# Altium project MiniPC MB GOST.PrjPcb (part 15 of 31)

## Sheet Converter 3V3-0V9 V2.SchDoc
size 420 x 297 mm; Author: ALTIUM GOSTBOM2.0 KEV; SheetNumber: 37; SheetTotal: 48
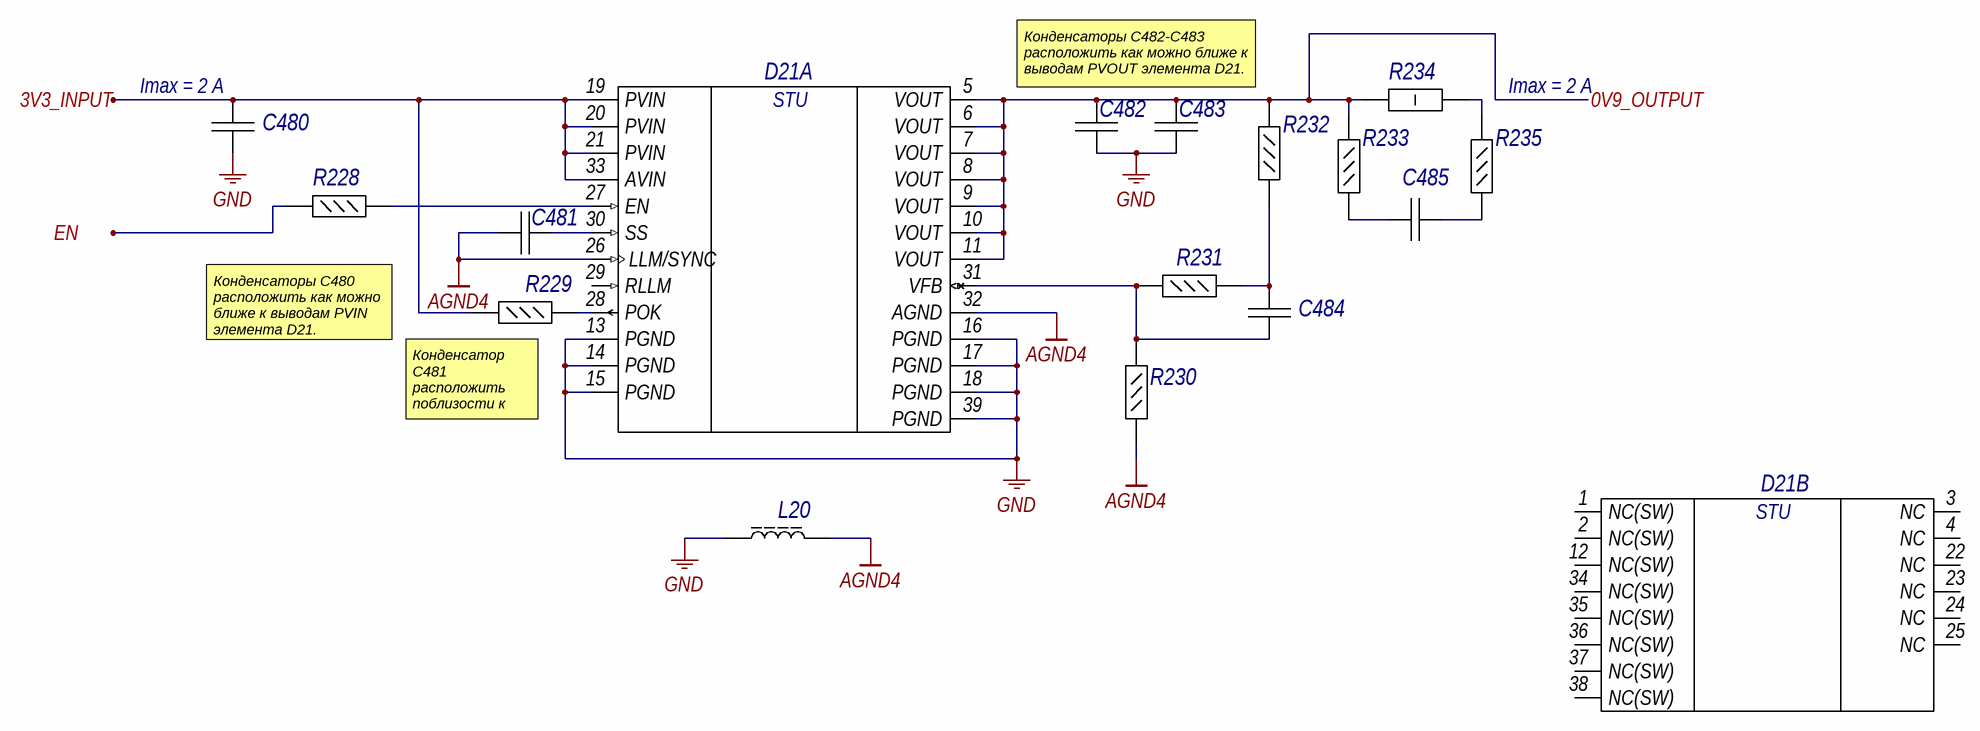
[diagram p19: Converter 3V3-0V9 V2.SchDoc]

### Parts
C480  GRM31CR61E226KE15L  [CAPC3216X180X55ML20T25]  (value not drawn)
C481  VJ0402Y153JXQPW1BC  [CAPC1005X55X23ML05T8]  (value not drawn)
C482  C3216X5R1A476M160AB  [CAPC3216X180X20ML20]  (value not drawn)
C483  C3216X5R1A476M160AB  [CAPC3216X180X20ML20]  (value not drawn)
C484  ECJ-0EC1H150J  [CAPC1005X55X20ML5T10]  (value not drawn)
C485  CGB2A1X5R1E105K033BC  [CAPC1005X33X10LL5]  (value not drawn)
D21  EN6337QI  [ALTR-QFN-38_A-190_D1-193_V]  (value not drawn)  (parts A,B of 2)
L20  742792609  [SMD-0603]  (value not drawn)
R228  NRC04F49R9TRF  [RESC1005X35X25NL8T10]  (value not drawn)
R229  ERJ-2RKF1003X  [RESC1005X40X25LL05T05]  (value not drawn)
R230  ERJ-2RKF1004X  [RESC1005X40X25LL05T05]  (value not drawn)
R231  ERJ-2RKF2003X  [RESC1005X40X25LL05T05]  (value not drawn)
R232  ERJ-2GE0R00X  [RESC1005X40X25LL05T05]  (value not drawn)
R233  ERJ-2RKF1002X  [RESC1005X40X25LL05T05]  (value not drawn)
R234  WSLP12061L000FEA  [RESC3216X89X104LL25T25]  (value not drawn)
R235  ERJ-2RKF1002X  [RESC1005X40X25LL05T05]  (value not drawn)

### Ports
0V9_OUTPUT, 3V3_INPUT, EN

### Nets
AGND4: C481.1 D21.26(LLM/SYNC) D21.32(AGND) L20.2 R230.1
GND: C480.1 C482.1 C483.1 D21.13(PGND) D21.14(PGND) D21.15(PGND) D21.16(PGND) D21.17(PGND) D21.18(PGND) D21.39(PGND) L20.1
0V95: C482.2 C483.2 D21.5(VOUT) D21.6(VOUT) D21.7(VOUT) D21.8(VOUT) D21.9(VOUT) D21.10(VOUT) D21.11(VOUT) R232.1 R233.2 R234.2 ; port 0V9_OUTPUT
3V3_OUTPUT: C480.2 D21.19(PVIN) D21.20(PVIN) D21.21(PVIN) D21.33(AVIN) R229.1 ; port 3V3_INPUT
NetC481_2: C481.2 D21.30(SS)
NetC484_1: C484.1 D21.31(VFB) R230.2 R231.1
NetC484_2: C484.2 R231.2 R232.2
NetC485_1: C485.1 R233.1
NetC485_2: C485.2 R235.1
NetD21_27: D21.27(EN) R228.2
NetD21_28: D21.28(POK) R229.2
NetR213_2: R228.1 ; port EN
NetR234_1: R234.1 R235.2

Not connected (* = marked no-connect by the designer): D21 1(NC(SW)) 2(NC(SW)) 3(NC) 4(NC) 12(NC(SW)) 22(NC) 23(NC) 24(NC) 25(NC) 29(RLLM) 34(NC(SW)) 35(NC(SW)) 36(NC(SW)) 37(NC(SW)) 38(NC(SW))

### Notes on the sheet
- Конденсаторы C482-C483 расположить как можно ближе к выводам PVOUT элемента D21.
- (near C480) Imax = 2 А
- Imax = 2 А
- Конденсаторы C480 расположить как можно ближе к выводам PVIN элемента D21.
- (near R229) Конденсатор C481 расположить поблизости к D21:30.
- Подп. дата
- Инв. № дубл.
- Взам. инв. №
- Подп. и дата
- Инв. № подл.
- Изм.
- Лист
- № докум.
- Подп.
- Дата
- ALTIUM GOSTBOM2.0 KEV
- Файл:
- Копировал
- Формат А3
- (in symbol E108, part A) STU
- (in symbol E108, part B) STU

### Library data of the parts
C480 = E5: Chip Capacitor, 22 uF, +/- 10%, 25 V, -55 to 85 degC, 1206 (3216 Metric), RoHS, Tape and Reel; Тип элемента: Конденсатор; Capacitance: 22 uF; Case\/Package: 1206; Type (Capacitors): X5R; Voltage Rating: 25 V; Old_des: C45; New_des: C480; UID: E5; Component Kind: Standard; Case Code (Imperial): 1206; Case Code (Metric): 3216; ComponentLink1Description: Manufacturer URL; ComponentLink1URL: http://www.murata.com/; ComponentLink2Description: Datasheet; ComponentLink2URL: http://search.murata.co.jp/Ceramy/image/img/A01X/G101/ENG/GRM31CR61E226KE15-01.pdf; DatasheetVersion: 03/2016; Length: 3.2 mm; Max Operating Temperature: 85 degC; Min Operating Temperature: -55 degC; Mounting Technology: Surface Mount; Package Quantity: 2000; PackageDescription: 2-Pin Surface Mount Device, Body 3.2 x 1.6 mm; Packaging: Tape and Reel; PartNumber: GRM31CR61E226KE15L; RoHSCompliant: true; Tolerance: 10%; Width: 1.6 mm; Height: 1.6 mm; Mount: Surface Mount; PackageReference: 1206; Pins: 2; Radiation Hardening: No; REACH SVHC: No SVHC; Voltage Rating (DC): 25 V
C481 = E8: Chip Capacitor, 15 nF, +/- 5%, 10 V, -55 to 125 degC, 0402 (1005 Metric), RoHS, Tape and Reel; Тип элемента: Конденсатор; Capacitance: 15 nF; Case\/Package: 0402; Type (Capacitors): X7R; Voltage Rating: 10 V; Old_des: C49; New_des: C481; UID: E8; Component Kind: Standard; Case Code (Imperial): 0402; Case Code (Metric): 1005; ComponentLink1Description: Manufacturer URL; ComponentLink1URL: http://www.vishay.com/; ComponentLink2Description: Datasheet; ComponentLink2URL: http://www.vishay.com/docs/28548/vjw1bcbascomseries.pdf; DatasheetVersion: 07/2016; Length: 1 mm; Max Operating Temperature: 125 degC; Min Operating Temperature: -55 degC; Mounting Technology: Surface Mount; Package Quantity: 50000; PackageDescription: 2-Pin Surface Mount Device, Body 1 x 0.5 mm; Packaging: Tape and Reel; PartNumber: VJ0402Y153JXQPW1BC; RoHSCompliant: true; Tolerance: 5%; Width: 0.5 mm; Height: 0.5 mm; Mount: Surface Mount; PackageReference: 0402; Pins: 2; Voltage Rating (DC): 10 V
C482 = E6: Chip Capacitor, 47 uF, +/- 20%, 10 V, -55 to 85 degC, 1206 (3216 Metric), RoHS, Tape and Reel; Тип элемента: Конденсатор; Capacitance: 47 uF; Case\/Package: 1206; Type (Capacitors): X5R; Voltage Rating: 10 V; Old_des: C46; New_des: C482; UID: E6; Component Kind: Standard; Case Code (Imperial): 1206; Case Code (Metric): 3216; ComponentLink1Description: Manufacturer URL; ComponentLink1URL: http://www.tdk.com/; ComponentLink2Description: Datasheet; ComponentLink2URL: https://product.tdk.com/info/en/catalog/datasheets/mlcc_commercial_general_en.pdf; DatasheetVersion: 03/2015; Length: 3.2 mm; Max Operating Temperature: 85 degC; Min Operating Temperature: -55 degC; Mounting Technology: Surface Mount; Package Quantity: 2000; PackageDescription: 2-Pin Surface Mount Device, Body 3.2 x 1.6 mm; Packaging: Tape and Reel; RoHSCompliant: true; Tolerance: 20%; Width: 1.6 mm; Height: 1.6 mm; Mount: Surface Mount; PackageReference: 3216; Radiation Hardening: No; Voltage Rating (DC): 10 V
C483 = E6: Chip Capacitor, 47 uF, +/- 20%, 10 V, -55 to 85 degC, 1206 (3216 Metric), RoHS, Tape and Reel; Тип элемента: Конденсатор; Capacitance: 47 uF; Case\/Package: 1206; Type (Capacitors): X5R; Voltage Rating: 10 V; Old_des: C47; New_des: C483; UID: E6; Component Kind: Standard; Case Code (Imperial): 1206; Case Code (Metric): 3216; ComponentLink1Description: Manufacturer URL; ComponentLink1URL: http://www.tdk.com/; ComponentLink2Description: Datasheet; ComponentLink2URL: https://product.tdk.com/info/en/catalog/datasheets/mlcc_commercial_general_en.pdf; DatasheetVersion: 03/2015; Length: 3.2 mm; Max Operating Temperature: 85 degC; Min Operating Temperature: -55 degC; Mounting Technology: Surface Mount; Package Quantity: 2000; PackageDescription: 2-Pin Surface Mount Device, Body 3.2 x 1.6 mm; Packaging: Tape and Reel; RoHSCompliant: true; Tolerance: 20%; Width: 1.6 mm; Height: 1.6 mm; Mount: Surface Mount; PackageReference: 3216; Radiation Hardening: No; Voltage Rating (DC): 10 V
C484 = E10: Chip Capacitor,15 pF, +/- 5%, 50 V, -55 to 125 degC, 0402 (1005 Metric), RoHS, Tape and Reel; Тип элемента: Конденсатор; Capacitance: 15 pF; Case\/Package: 0402; Type (Capacitors): C0G; Voltage Rating: 50 V; Old_des: C48; New_des: C484; UID: E10; Component Kind: Standard; Case Code (Imperial): 0402; Case Code (Metric): 1005; ComponentLink1Description: Manufacturer URL; ComponentLink1URL: http://www.panasonic.com/; ComponentLink2Description: Datasheet; ComponentLink2URL: http://www.mouser.com/ds/2/315/panasonic_abj0000ce4-327307.pdf; DatasheetVersion: 09/2008; Length: 0.039 inch; Max Operating Temperature: 125 degC; Min Operating Temperature: -55 degC; Mounting Technology: Surface Mount; Package Quantity: 10000; PackageDescription: 2-Pin Surface Mount Device, Body 1 x 0.5 mm; Packaging: Tape and Reel; RoHSCompliant: true; Tolerance: 5%; Width: 0.02 inch; Height: 0.5 mm; Mount: Surface Mount; PackageReference: 0402
C485 = E2: Chip Capacitor, 1 uF, +/- 10%, 25 V, -55 to 85 degC, 0402 (1005 Metric), RoHS, Tape and Reel; Тип элемента: Конденсатор; Capacitance: 1 uF; Old_des: C44; New_des: C485; UID: E2; Component Kind: Standard; Case Code (Imperial): 0402; Case Code (Metric): 1005; Case/Package: 0402; ComponentLink1Description: Manufacturer URL; ComponentLink1URL: http://www.tdk.com/; ComponentLink2Description: Datasheet; ComponentLink2URL: https://product.tdk.com/info/en/catalog/datasheets/mlcc_commercial_lowprofile_en.pdf; DatasheetVersion: 04/2015; Length: 0.039 inch; Max Operating Temperature: 85 degC; Min Operating Temperature: -55 degC; Mounting Technology: Surface Mount; Package Quantity: 1; PackageDescription: 2-Pin Surface Mount Device, Body 1 x 0.5 mm; Packaging: Tape and Reel; PartNumber: CGB2A1X5R1E105K033BC; RoHSCompliant: True; Tolerance: 10%; Width: 0.02 inch
D21 = E108: PowerSoC Voltage Mode Synchronous PWM Buck with Integrated Inductor, 2.5 to 6.6 V Input, -40 to 85 degC, 38-Pin QFN, RoHS, Tape and Reel; Тип элемента: Стабилизатор; Output Current: 3 A; Old_des: U6; New_des: D21; UID: E108; Component Kind: Standard; ComponentLink1Description: Manufacturer URL; ComponentLink1URL: https://www.altera.com/; ComponentLink2Description: Datasheet; ComponentLink2URL: https://www.altera.com/content/dam/altera-www/global/en_US/pdfs/literature/ds/en6337qi_05800.pdf; DatasheetVersion: Rev. E; Length: 0.28 inch; Max Operating Temperature: 85 degC; Min Operating Temperature: -40 degC; Mounting Technology: Surface Mount; Package Quantity: 500; PackageDescription: 38-Pin Quad Flat No-Leads Package, Body 7 x 4 mm, Pitch 0.5 mm, Thermal Pad 2.6 x 1.94 mm; Packaging: Tape and Reel; PartNumber: EN6337QI; RoHSCompliant: True; Width: 0.16 inch; Height: 0.07 inch; Mount: Surface Mount; Pins: 38; Radiation Hardening: No
L20 = E45: SMD EMI Suppression Ferrite Bead WE-CBF, Z = 30 Ohm; Тип элемента: Ферритовый дроссель; Impedance: 30 Ohm; Old_des: L5; New_des: L20; UID: E45; Component Kind: Standard; ComponentLink1Description: Manufacturer Link; ComponentLink1URL: http://www.we-online.com; ComponentLink2Description: Datasheet; ComponentLink2URL: http://www.we-online.de/katalog/media/pdf/742792609.pdf; DatasheetVersion: Dec-2005; PackageDescription: Chip Inductor, 2-Leads, Body 1.6 x 0.8 mm; PackageReference: SMD-0603; PackageVersion: 2009
R228 = E67: Chip Resistor, 49.9 Ohm, +/- 1%, 0.06 W, -55 to 155 degC, 0402 (1005 Metric), RoHS, Tape and Reel; Тип элемента: Резистор; Old_des: R87; New_des: R228; UID: E67; Component Kind: Standard; Case/Package: 0402; ComponentLink1Description: Manufacturer URL; ComponentLink1URL: http://www.niccomp.com/; ComponentLink2Description: Datasheet; ComponentLink2URL: https://datasheet.ciiva.com/27056/2008575-27056094.pdf; DatasheetVersion: 11/2008; Length: 1 mm; Max Operating Temperature: 155 degC; Min Operating Temperature: -55 degC; Mounting Technology: Surface Mount; PackageDescription: 2-Pin Surface Mount Device, Body 1 x 0.5 mm; Packaging: Tape and Reel; PartNumber: NRC04F49R9TRF; RoHSCompliant: True; Tolerance: 1%; Height: 0.3 mm; Radiation Hardening: No; Resistance: 49.9 Ohm
R229 = E58: Chip Resistor, 100 KOhm, +/- 1%, 100 mW, -55 to 155 degC, 0402 (1005 Metric), RoHS, Tape and Reel; Manufacturer: Basic Passives; Тип элемента: Резистор; Case\/Package: 0402; Voltage Rating: 50 V; Power Rating: 100 mW; Old_des: R89; New_des: R229; UID: E58; Component Kind: Standard; Case Code (Imperial): 0402; Case Code (Metric): 1005; ComponentLink1Description: Manufacturer URL; ComponentLink1URL: http://www.panasonic.com/; ComponentLink2Description: Datasheet; ComponentLink2URL: http://industrial.panasonic.com/cdbs/www-data/pdf/RDA0000/AOA0000C86.pdf; DatasheetVersion: 04/2015; Length: 1 mm; Max Operating Temperature: 155 degC; Min Operating Temperature: -55 degC; Mounting Technology: Surface Mount; Package Quantity: 10000; PackageDescription: 2-Pin Surface Mount Device, Body 1 x 0.5 mm; Packaging: Tape and Reel; PartNumber: ERJ-2RKF1003X; RoHSCompliant: true; Tolerance: 1%; Width: 0.5 mm; Height: 0.35 mm; Mount: Surface Mount; PackageReference: 0402; Pins: 2; Radiation Hardening: No; REACH SVHC: Yes; Resistance: 100 KOhm
R230 = E81: Chip Resistor, 1 MOhm, +/- 1%, 100 mW, -55 to 155 degC, 0402 (1005 Metric), RoHS, Tape and Reel; Manufacturer: Basic Passives; Тип элемента: Резистор; Case\/Package: 0402; Voltage Rating: 50 V; Power Rating: 100 mW; Resistance: 1 MOhm; Old_des: R88; New_des: R230; UID: E81; Component Kind: Standard; Case Code (Imperial): 0402; Case Code (Metric): 1005; ComponentLink1Description: Manufacturer URL; ComponentLink1URL: http://www.panasonic.com/; ComponentLink2Description: Datasheet; ComponentLink2URL: http://industrial.panasonic.com/cdbs/www-data/pdf/RDA0000/AOA0000C86.pdf; DatasheetVersion: 04/2015; Length: 1 mm; Max Operating Temperature: 155 degC; Min Operating Temperature: -55 degC; Mounting Technology: Surface Mount; Package Quantity: 10000; PackageDescription: 2-Pin Surface Mount Device, Body 1 x 0.5 mm; Packaging: Tape and Reel; PartNumber: ERJ-2RKF1004X; RoHSCompliant: true; Tolerance: 1%; Width: 0.5 mm; Height: 0.35 mm; Mount: Surface Mount; PackageReference: 0402; Pins: 2; Radiation Hardening: No; REACH SVHC: Yes; Weight: 2.8E-05oz
R231 = E80: Chip Resistor, 200 KOhm, +/- 1%, 100 mW, -55 to 155 degC, 0402 (1005 Metric), RoHS, Tape and Reel; Manufacturer: Basic Passives; Тип элемента: Резистор; Case\/Package: 0402; Voltage Rating: 50 V; Power Rating: 100 mW; Old_des: R86; New_des: R231; UID: E80; Component Kind: Standard; Case Code (Imperial): 0402; Case Code (Metric): 1005; ComponentLink1Description: Manufacturer URL; ComponentLink1URL: http://www.panasonic.com/; ComponentLink2Description: Datasheet; ComponentLink2URL: http://industrial.panasonic.com/cdbs/www-data/pdf/RDA0000/AOA0000C86.pdf; DatasheetVersion: 04/2015; Length: 1 mm; Max Operating Temperature: 155 degC; Min Operating Temperature: -55 degC; Mounting Technology: Surface Mount; Package Quantity: 10000; PackageDescription: 2-Pin Surface Mount Device, Body 1 x 0.5 mm; Packaging: Tape and Reel; PartNumber: ERJ-2RKF2003X; RoHSCompliant: true; Tolerance: 1%; Width: 0.5 mm; Height: 0.35 mm; Mount: Surface Mount; PackageReference: 0402; Pins: 2; Radiation Hardening: No; REACH SVHC: No SVHC; Resistance: 200 KOhm
R232 = E64: Chip Resistor, 0 mOhm, +/- 5%, 100 mW, -55 to 155 degC, 0402 (1005 Metric), RoHS, Tape and Reel; Manufacturer: Basic Passives; Тип элемента: Резистор; Case\/Package: 0402; Voltage Rating: 50 V; Power Rating: 100 mW; Resistance: 0 mOhm; Old_des: R85; New_des: R232; UID: E64; Component Kind: Standard; Case Code (Imperial): 0402; Case Code (Metric): 1005; ComponentLink1Description: Manufacturer URL; ComponentLink1URL: http://www.panasonic.com/; ComponentLink2Description: Datasheet; ComponentLink2URL: http://industrial.panasonic.com/cdbs/www-data/pdf/RDA0000/AOA0000C84.pdf; DatasheetVersion: 03/2015; Length: 1 mm; Max Operating Temperature: 155 degC; Min Operating Temperature: -55 degC; Mounting Technology: Surface Mount; Package Quantity: 10000; PackageDescription: 2-Pin Surface Mount Device, Body 1 x 0.5 mm; Packaging: Tape and Reel; PartNumber: ERJ-2GE0R00X; RoHSCompliant: true; Tolerance: 5%; Width: 0.5 mm; Height: 0.35 mm; Mount: Surface Mount; PackageReference: 0402; Pins: 2; Radiation Hardening: No; REACH SVHC: Unknown
R233 = E60: Chip Resistor, 10 KOhm, +/- 1%, 100 mW, -55 to 155 degC, 0402 (1005 Metric), RoHS, Tape and Reel; Manufacturer: Basic Passives; Тип элемента: Резистор; Case\/Package: 0402; Voltage Rating: 50 V; Power Rating: 100 mW; Resistance: 10 KOhm; Old_des: R84; New_des: R233; UID: E60; Component Kind: Standard; Case Code (Imperial): 0402; Case Code (Metric): 1005; ComponentLink1Description: Manufacturer URL; ComponentLink1URL: http://www.panasonic.com/; ComponentLink2Description: Datasheet; ComponentLink2URL: http://industrial.panasonic.com/cdbs/www-data/pdf/RDA0000/AOA0000C86.pdf; DatasheetVersion: 04/2015; Length: 1 mm; Max Operating Temperature: 155 degC; Min Operating Temperature: -55 degC; Mounting Technology: Surface Mount; Package Quantity: 10000; PackageDescription: 2-Pin Surface Mount Device, Body 1 x 0.5 mm; Packaging: Tape and Reel; PartNumber: ERJ-2RKF1002X; RoHSCompliant: true; Tolerance: 1%; Width: 0.5 mm; Height: 0.35 mm; Mount: Surface Mount; PackageReference: 0402; Pins: 2; Radiation Hardening: No; REACH SVHC: Yes
R234 = E65: Chip Resistor, 0.001 Ohm, +/- 1%, 1 W, -65 to 170 degC, 1206 (3216 Metric), RoHS, Tape and Reel; Тип элемента: Резистор; Old_des: R83; New_des: R234; UID: E65; Component Kind: Standard; Case Code (Imperial): 1206; Case Code (Metric): 3216; Case/Package: 1206; ComponentLink1Description: Manufacturer URL; ComponentLink1URL: http://www.vishay.com/; ComponentLink2Description: Datasheet; ComponentLink2URL: http://www.farnell.com/datasheets/2049155.pdf; DatasheetVersion: 04/2015; Length: 3.2 mm; Max Operating Temperature: 170 degC; Min Operating Temperature: -65 degC; Mounting Technology: Surface Mount; PackageDescription: 2-Pin Surface Mount Device, Body 3.2 x 1.6 mm; Packaging: Tape and Reel; PartNumber: WSLP12061L000FEA; RoHSCompliant: True; Tolerance: 1%; Width: 1.6 mm; Height: 0.635 mm; REACH SVHC: Unknown; Resistance: 0.001 Ohm
R235 = E60: Chip Resistor, 10 KOhm, +/- 1%, 100 mW, -55 to 155 degC, 0402 (1005 Metric), RoHS, Tape and Reel; Manufacturer: Basic Passives; Тип элемента: Резистор; Case\/Package: 0402; Voltage Rating: 50 V; Power Rating: 100 mW; Resistance: 10 KOhm; Old_des: R82; New_des: R235; UID: E60; Component Kind: Standard; Case Code (Imperial): 0402; Case Code (Metric): 1005; ComponentLink1Description: Manufacturer URL; ComponentLink1URL: http://www.panasonic.com/; ComponentLink2Description: Datasheet; ComponentLink2URL: http://industrial.panasonic.com/cdbs/www-data/pdf/RDA0000/AOA0000C86.pdf; DatasheetVersion: 04/2015; Length: 1 mm; Max Operating Temperature: 155 degC; Min Operating Temperature: -55 degC; Mounting Technology: Surface Mount; Package Quantity: 10000; PackageDescription: 2-Pin Surface Mount Device, Body 1 x 0.5 mm; Packaging: Tape and Reel; PartNumber: ERJ-2RKF1002X; RoHSCompliant: true; Tolerance: 1%; Width: 0.5 mm; Height: 0.35 mm; Mount: Surface Mount; PackageReference: 0402; Pins: 2; Radiation Hardening: No; REACH SVHC: Yes

## Sheet Ethernet Interface Group.SchDoc
size 209 x 297 mm; Author: ALTIUM GOSTBOM2.0 KEV; SheetNumber: 9; SheetTotal: 48
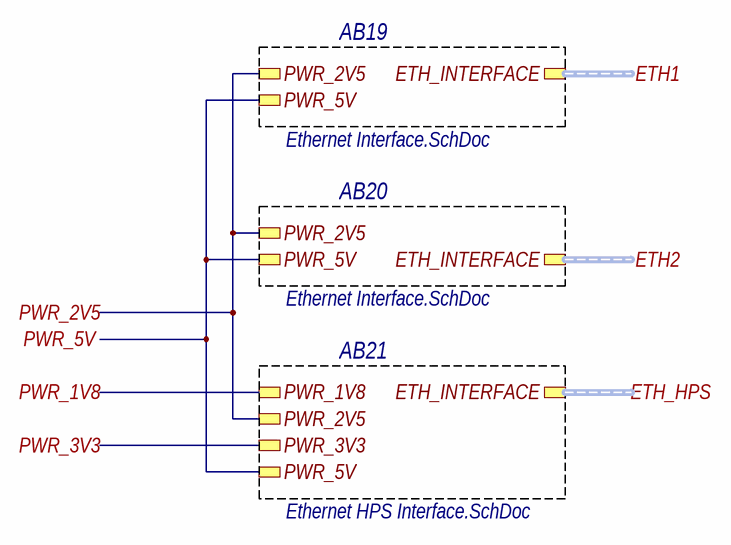
[diagram p20: Ethernet Interface Group.SchDoc]

### Sub-sheets
AB19 = Ethernet Interface.SchDoc: PWR_5V, ETH_INTERFACE (harness ETHERNET), PWR_2V5
AB20 = Ethernet Interface.SchDoc: PWR_5V, ETH_INTERFACE (harness ETHERNET), PWR_2V5
AB21 = Ethernet HPS Interface.SchDoc: ETH_INTERFACE (harness ETHERNET_HPS), PWR_5V, PWR_3V3, PWR_2V5, PWR_1V8

### Ports
ETH1 (harness ETHERNET), ETH2 (harness ETHERNET), ETH_HPS (harness ETHERNET_HPS), PWR_1V8, PWR_2V5, PWR_3V3, PWR_5V

### Nets
IO_1V8: port PWR_1V8, sheet AB21/PWR_1V8
IO_2V5: port PWR_2V5, sheet AB19/PWR_2V5, sheet AB21/PWR_2V5, sheet AB20/PWR_2V5
IO_3V3: port PWR_3V3, sheet AB21/PWR_3V3
IO_5V: port PWR_5V, sheet AB19/PWR_5V, sheet AB21/PWR_5V, sheet AB20/PWR_5V

### Buses and harness runs
harness port ETH1 = sheet AB19/ETH_INTERFACE
harness port ETH2 = sheet AB20/ETH_INTERFACE
harness port ETH_HPS = sheet AB21/ETH_INTERFACE

### Notes on the sheet
- Подп. дата
- Инв. № дубл.
- Взам. инв. №
- Подп. и дата
- Инв. № подл.
- Изм.
- Лист
- № докум.
- Подп.
- Дата
- Файл:
- ALTIUM GOSTBOM2.0 KEV
- Копировал
- Формат А4

## Sheet Ethernet Interface.SchDoc
size 594 x 420 mm; Author: ALTIUM GOSTBOM2.0 KEV; SheetNumber: 12; SheetTotal: 48
Used 2 times, as channels A2/AB19, A2/AB20. Parts and nets are listed once, with the designators drawn on the sheet.
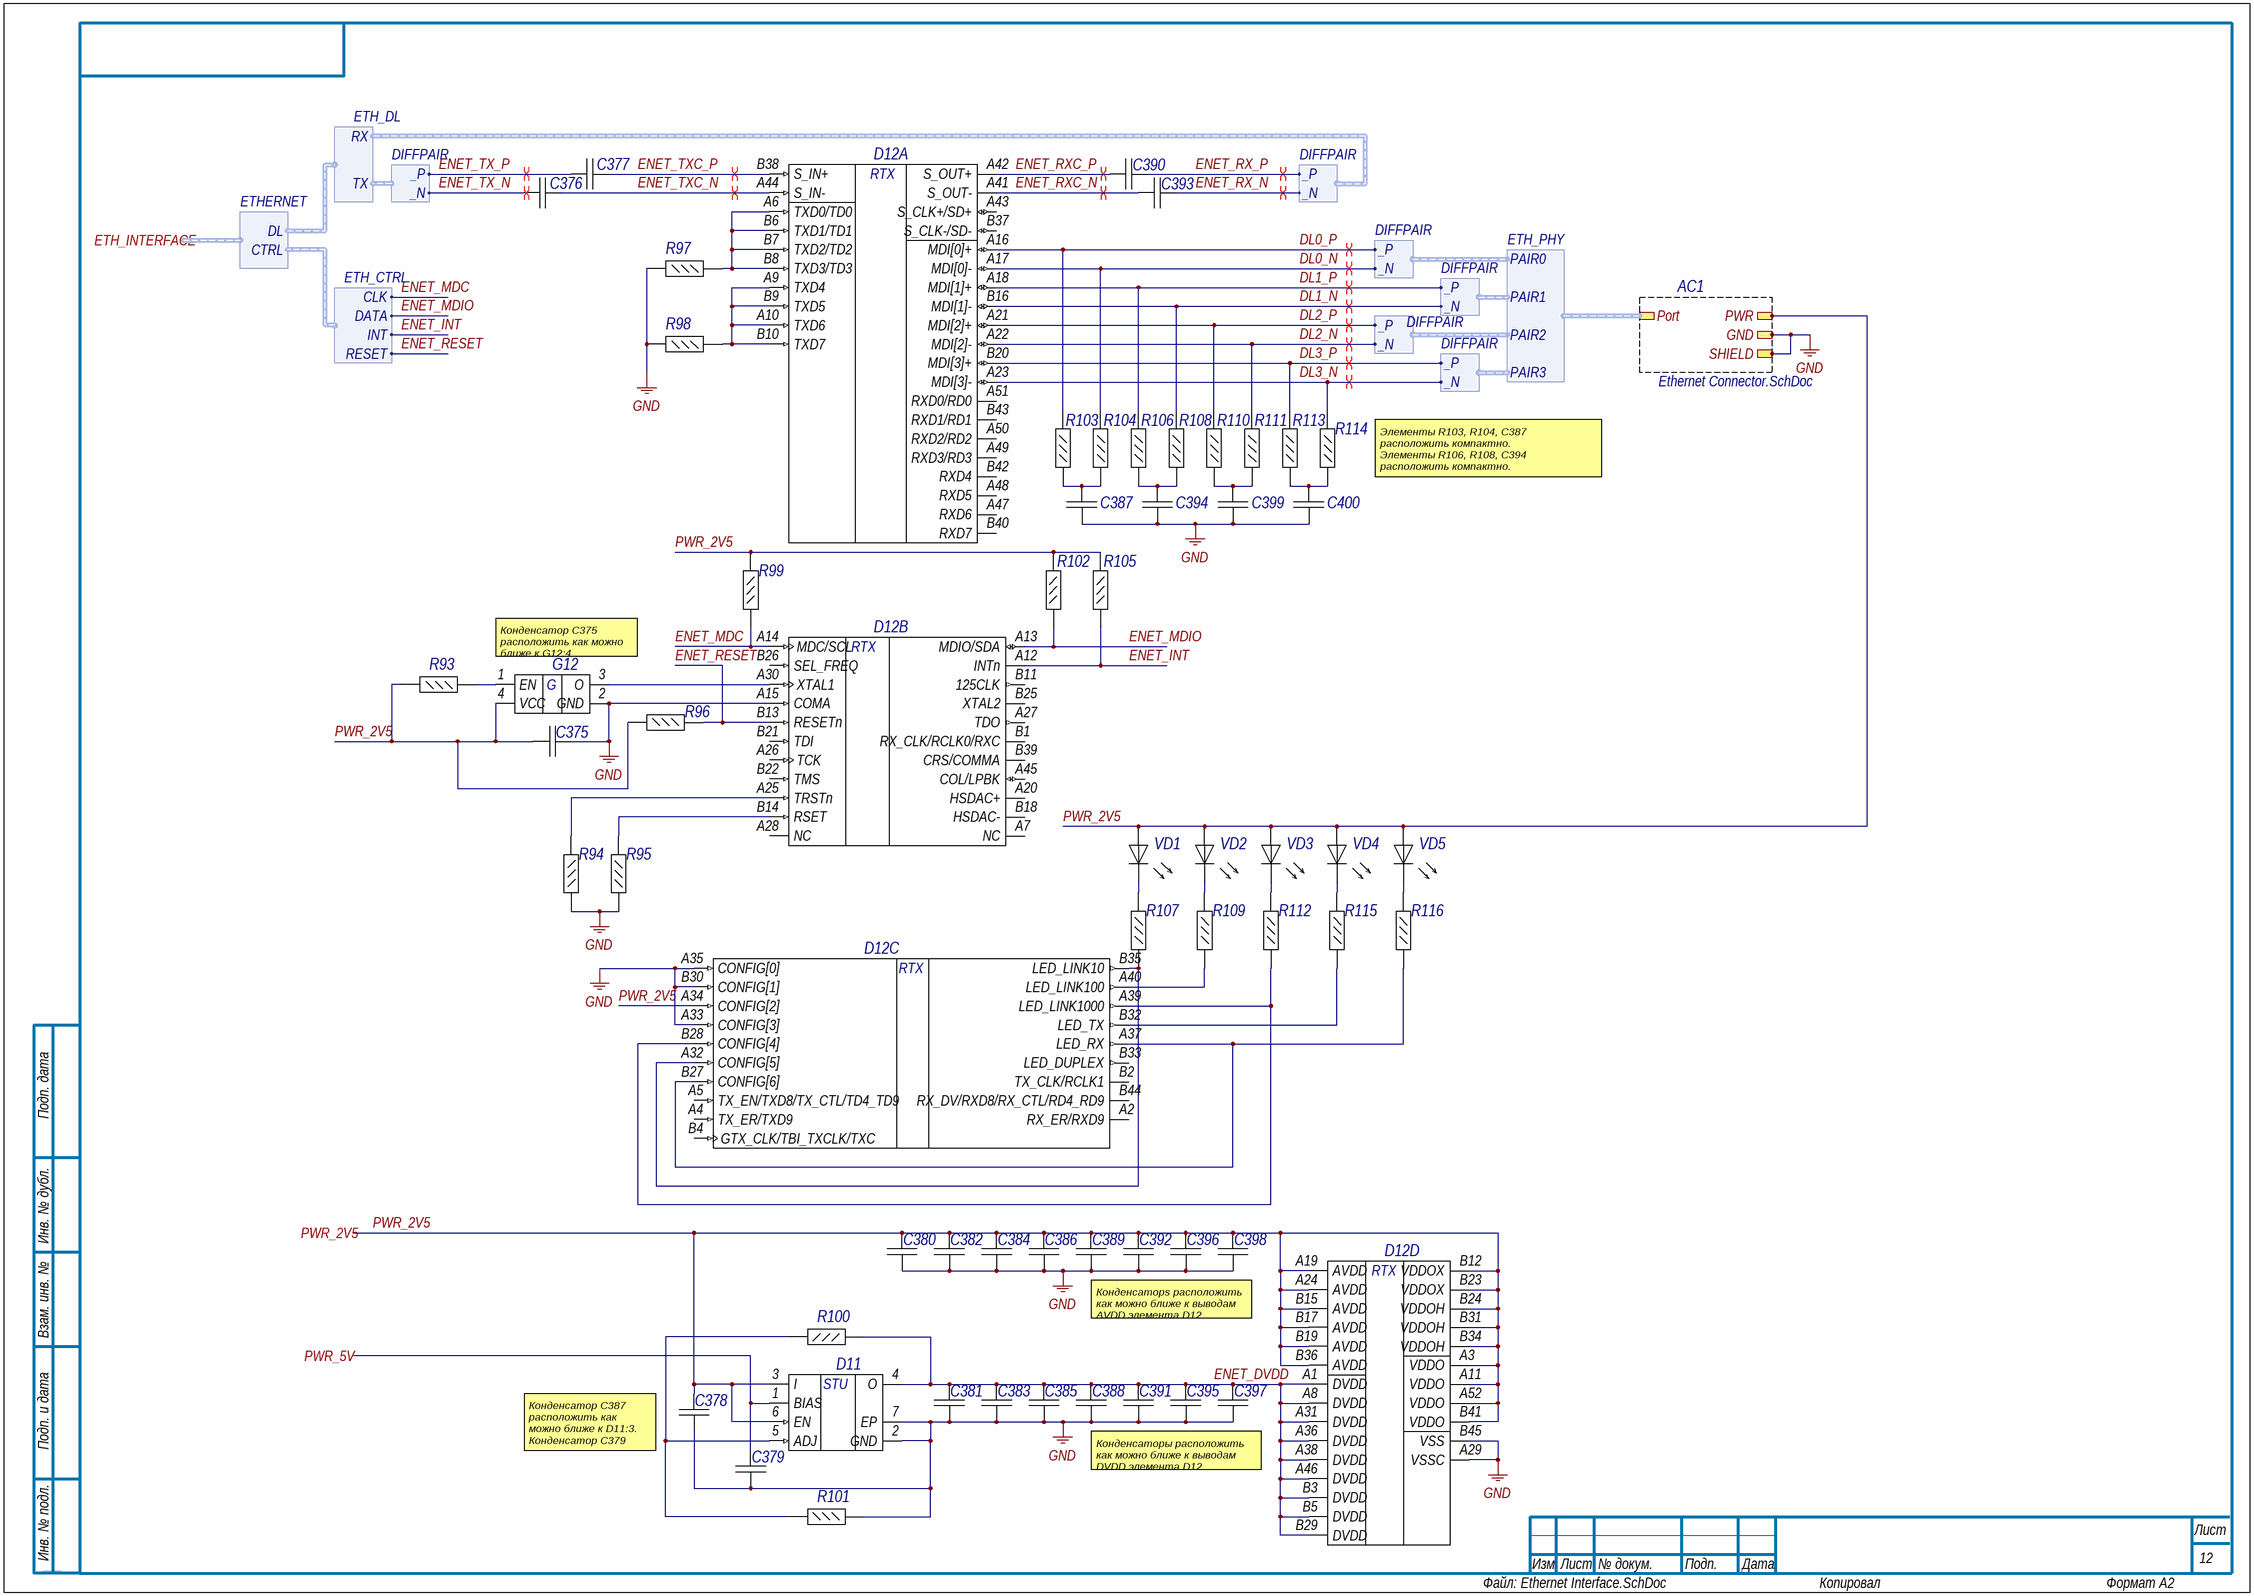
[diagram p21: Ethernet Interface.SchDoc]

### Parts
C375  GRM155R71H103KA88D  [CAPC1005X55X25ML05T10]  (value not drawn)
C376  C1005X7R1E104M  [CAPC1005X55X10LL05]  (value not drawn)
C377  C1005X7R1E104M  [CAPC1005X55X10LL05]  (value not drawn)
C378  C2012X5R1C106K085AC  [CAPC2013X100X20NL20]  (value not drawn)
C379  CGB2A1X5R1E105K033BC  [CAPC1005X33X10LL5]  (value not drawn)
C380  C1005X7R1E104M  [CAPC1005X55X10LL05]  (value not drawn)
C381  GRM31CR61E226KE15L  [CAPC3216X180X55ML20T25]  (value not drawn)
C382  C1005X7R1E104M  [CAPC1005X55X10LL05]  (value not drawn)
C383  GRM188R61A225KE34x  [CAPC1608X90X35ML10T15]  (value not drawn)
C384  C1005X7R1E104M  [CAPC1005X55X10LL05]  (value not drawn)
C385  C1005X7R1E104M  [CAPC1005X55X10LL05]  (value not drawn)
C386  C1005X7R1E104M  [CAPC1005X55X10LL05]  (value not drawn)
C387  GRM155R71H103KA88D  [CAPC1005X55X25ML05T10]  (value not drawn)
C388  C1005X7R1E104M  [CAPC1005X55X10LL05]  (value not drawn)
C389  C1005X7R1E104M  [CAPC1005X55X10LL05]  (value not drawn)
C390  C1005X7R1E104M  [CAPC1005X55X10LL05]  (value not drawn)
C391  C1005X7R1E104M  [CAPC1005X55X10LL05]  (value not drawn)
C392  C1005X7R1E104M  [CAPC1005X55X10LL05]  (value not drawn)
C393  C1005X7R1E104M  [CAPC1005X55X10LL05]  (value not drawn)
C394  GRM155R71H103KA88D  [CAPC1005X55X25ML05T10]  (value not drawn)
C395  C1005X7R1E104M  [CAPC1005X55X10LL05]  (value not drawn)
C396  C1005X7R1E104M  [CAPC1005X55X10LL05]  (value not drawn)
C397  C1005X7R1E104M  [CAPC1005X55X10LL05]  (value not drawn)
C398  C1005X7R1E104M  [CAPC1005X55X10LL05]  (value not drawn)
C399  GRM155R71H103KA88D  [CAPC1005X55X25ML05T10]  (value not drawn)
C400  GRM155R71H103KA88D  [CAPC1005X55X25ML05T10]  (value not drawn)
D11  LTC3025EDC-1#PBF  [LT-DC6-6_V]  (value not drawn)
D12  88E1111-B2-NDC2C000  [MARV-NDC96]  (value not drawn)  (parts A,B,C,D of 4)
G12  SG-310SDF 25.0000M-B3  [EPSON-SG-310-4_V]  (value not drawn)
R93  ERJ-2RKF1002X  [RESC1005X40X25LL05T05]  (value not drawn)
R94  ERJ-2RKF4701X  [RESC1005X40X25LL05T05]  (value not drawn)
R95  ERJ-2RKF4991X  [RESC1005X40X25LL05T05]  (value not drawn)
R96  ERJ-2RKF4701X  [RESC1005X40X25LL05T05]  (value not drawn)
R97  ERJ-2GE0R00X  [RESC1005X40X25LL05T05]  (value not drawn)
R98  ERJ-2GE0R00X  [RESC1005X40X25LL05T05]  (value not drawn)
R99  ERJ-2RKF4701X  [RESC1005X40X25LL05T05]  (value not drawn)
R100  ERJ-2RKF1502X  [RESC1005X40X25LL05T05]  (value not drawn)
R101  ERJ-2RKF1002X  [RESC1005X40X25LL05T05]  (value not drawn)
R102  NRC04F49R9TRF  [RESC1005X35X25NL8T10]  (value not drawn)
R103  NRC04F49R9TRF  [RESC1005X35X25NL8T10]  (value not drawn)
R104  NRC04F49R9TRF  [RESC1005X35X25NL8T10]  (value not drawn)
R105  ERJ-2RKF4701X  [RESC1005X40X25LL05T05]  (value not drawn)
R106  NRC04F49R9TRF  [RESC1005X35X25NL8T10]  (value not drawn)
R107  ERJ-2RKF2400X  [RESC1005X40X25LL05T05]  (value not drawn)
R108  NRC04F49R9TRF  [RESC1005X35X25NL8T10]  (value not drawn)
R109  ERJ-2RKF2400X  [RESC1005X40X25LL05T05]  (value not drawn)
R110  NRC04F49R9TRF  [RESC1005X35X25NL8T10]  (value not drawn)
R111  NRC04F49R9TRF  [RESC1005X35X25NL8T10]  (value not drawn)
R112  ERJ-2RKF2400X  [RESC1005X40X25LL05T05]  (value not drawn)
R113  NRC04F49R9TRF  [RESC1005X35X25NL8T10]  (value not drawn)
R114  NRC04F49R9TRF  [RESC1005X35X25NL8T10]  (value not drawn)
R115  ERJ-2RKF2400X  [RESC1005X40X25LL05T05]  (value not drawn)
R116  ERJ-2RKF2400X  [RESC1005X40X25LL05T05]  (value not drawn)
VD1  150060VS75000  [0603_A]  (value not drawn)
VD2  150060VS75000  [0603_A]  (value not drawn)
VD3  150060VS75000  [0603_A]  (value not drawn)
VD4  150060VS75000  [0603_A]  (value not drawn)
VD5  150060VS75000  [0603_A]  (value not drawn)

### Sub-sheets
AC1 = Ethernet Connector.SchDoc: GND, PWR, Port (harness ETH_PHY), SHIELD

### Ports
ETH_INTERFACE (harness ETHERNET), PWR_2V5, PWR_5V

### Harnesses
DIFFPAIR: _P, _N
ETH_DL: RX, TX
ETH_PHY: PAIR0, PAIR1, PAIR2, PAIR3
ETH_CTRL: DATA, CLK, INT, RESET
ETHERNET: DL, CTRL

### Nets
GND: C375.1 C378.1 C379.1 C380.1 C381.1 C382.1 C383.1 C384.1 C385.1 C386.1 C387.2 C388.1 C389.1 C391.1 C392.1 C394.2 C395.1 C396.1 C397.1 C398.1 C399.2 C400.2 D11.2(GND) D11.7(EP) D12.A15(COMA) D12.A29(VSSC) D12.A33(CONFIG[3]) D12.A35(CONFIG[0]) D12.B30(CONFIG[1]) D12.B45(VSS) G12.2(GND) R94.2 R95.2 R97.1 R98.1 R101.1 ; sheet AC1/GND, sheet AC1/SHIELD
DL0_N: D12.A17(MDI[0]-) R104.1 ; harness DIFFPAIR._N
DL0_P: D12.A16(MDI[0]+) R103.1 ; harness DIFFPAIR._P
DL1_N: D12.B16(MDI[1]-) R108.1 ; harness DIFFPAIR._N
DL1_P: D12.A18(MDI[1]+) R106.1 ; harness DIFFPAIR._P
DL2_N: D12.A22(MDI[2]-) R111.1 ; harness DIFFPAIR._N
DL2_P: D12.A21(MDI[2]+) R110.1 ; harness DIFFPAIR._P
DL3_N: D12.A23(MDI[3]-) R114.1 ; harness DIFFPAIR._N
DL3_P: D12.B20(MDI[3]+) R113.1 ; harness DIFFPAIR._P
ENET_DVDD: C381.2 C383.2 C385.2 C388.2 C391.2 C395.2 C397.2 D11.4(O) D12.A1(DVDD) D12.A8(DVDD) D12.A31(DVDD) D12.A36(DVDD) D12.A38(DVDD) D12.A46(DVDD) D12.B3(DVDD) D12.B5(DVDD) D12.B29(DVDD) R100.2  [project net ENET_DVDD_12]
ENET_INT: D12.A12(INTn) R105.1 ; harness ETH_CTRL.INT
ENET_MDC: D12.A14(MDC/SCL) R99.1 ; harness ETH_CTRL.CLK
ENET_MDIO: D12.A13(MDIO/SDA) R102.1 ; harness ETH_CTRL.DATA
ENET_RESET: D12.B13(RESETn) R96.1 ; harness ETH_CTRL.RESET
ENET_RX_N: C393.1 ; harness DIFFPAIR._N
ENET_RX_P: C390.1 ; harness DIFFPAIR._P
ENET_RXC_N: C393.2 D12.A41(S_OUT-)  [project net ENET_RXC_N_12]
ENET_RXC_P: C390.2 D12.A42(S_OUT+)  [project net ENET_RXC_P_12]
ENET_TX_N: C376.1 ; harness DIFFPAIR._N
ENET_TX_P: C377.1 ; harness DIFFPAIR._P
ENET_TXC_N: C376.2 D12.A44(S_IN-)  [project net ENET_TXC_N_12]
ENET_TXC_P: C377.2 D12.B38(S_IN+)  [project net ENET_TXC_P_12]
PWR_2V5: C375.2 C378.2 C380.2 C382.2 C384.2 C386.2 C389.2 C392.2 C396.2 C398.2 D11.3(I) D11.6(EN) D12.A3(VDDO) D12.A11(VDDO) D12.A19(AVDD) D12.A24(AVDD) D12.A34(CONFIG[2]) D12.A52(VDDO) D12.B12(VDDOX) D12.B15(AVDD) D12.B17(AVDD) D12.B19(AVDD) D12.B23(VDDOX) D12.B24(VDDOH) D12.B31(VDDOH) D12.B34(VDDOH) D12.B36(AVDD) D12.B41(VDDO) G12.4(VCC) R93.1 R96.2 R99.2 R102.2 R105.2 VD1.2(A) VD2.2(A) VD3.2(A) VD4.2(A) VD5.2(A) ; port PWR_2V5, sheet AC1/PWR
PWR_5V: C379.2 D11.1(BIAS) ; port PWR_5V
NetC387_1: C387.1 R103.2 R104.2
NetC394_1: C394.1 R106.2 R108.2
NetC399_1: C399.1 R110.2 R111.2
NetC400_1: C400.1 R113.2 R114.2
NetD11_5: D11.5(ADJ) R100.1 R101.2
NetD12_A6: D12.A6(TXD0/TD0) D12.B6(TXD1/TD1) D12.B7(TXD2/TD2) D12.B8(TXD3/TD3) R97.2
NetD12_A9: D12.A9(TXD4) D12.A10(TXD6) D12.B9(TXD5) D12.B10(TXD7) R98.2
NetD12_A25: D12.A25(TRSTn) R94.1
NetD12_A30: D12.A30(XTAL1) G12.3(O)
NetD12_A32: D12.A32(CONFIG[5]) D12.B35(LED_LINK10) R107.2
NetD12_A37: D12.A37(LED_RX) D12.B27(CONFIG[6]) R116.2
NetD12_A39: D12.A39(LED_LINK1000) D12.B28(CONFIG[4]) R112.2
NetD12_A40: D12.A40(LED_LINK100) R109.2
NetD12_B14: D12.B14(RSET) R95.1
NetD12_B32: D12.B32(LED_TX) R115.2
NetG12_1: G12.1(EN) R93.2
NetR107_1: R107.1 VD1.1(K)
NetR109_1: R109.1 VD2.1(K)
NetR112_1: R112.1 VD3.1(K)
NetR115_1: R115.1 VD4.1(K)
NetR116_1: R116.1 VD5.1(K)

Not connected (* = marked no-connect by the designer): D12 A2(RX_ER/RXD9) A4(TX_ER/TXD9) A5(TX_EN/TXD8/TX_CTL/TD4_TD9) A7(NC) A20(HSDAC+) A26(TCK) A27(TDO) A28(NC) A43(S_CLK+/SD+) A45(COL/LPBK) A47(RXD6) A48(RXD5) A49(RXD3/RD3) A50(RXD2/RD2) A51(RXD0/RD0) B1(RX_CLK/RCLK0/RXC) B2(TX_CLK/RCLK1) B4(GTX_CLK/TBI_TXCLK/TXC) B11(125CLK) B18(HSDAC-) B21(TDI) B22(TMS) B25(XTAL2) B26(SEL_FREQ) B33(LED_DUPLEX) B37(S_CLK-/SD-) B39(CRS/COMMA) B40(RXD7) B42(RXD4) B43(RXD1/RD1) B44(RX_DV/RXD8/RX_CTL/RD4_RD9)

### Channels
A2/AB19: designators C375=AB1C375 C376=AB1C376 C377=AB1C377 C378=AB1C378 C379=AB1C379 C380=AB1C380 C381=AB1C381 C382=AB1C382 C383=AB1C383 C384=AB1C384 C385=AB1C385 C386=AB1C386 C387=AB1C387 C388=AB1C388 C389=AB1C389 C390=AB1C390 C391=AB1C391 C392=AB1C392 C393=AB1C393 C394=AB1C394 C395=AB1C395 C396=AB1C396 C397=AB1C397 C398=AB1C398 C399=AB1C399 C400=AB1C400 D11=AB1D11 D12=AB1D12 G12=AB1G12 R93=AB1R93 R94=AB1R94 R95=AB1R95 R96=AB1R96 R97=AB1R97 R98=AB1R98 R99=AB1R99 R100=AB1R100 R101=AB1R101 R102=AB1R102 R103=AB1R103 R104=AB1R104 R105=AB1R105 R106=AB1R106 R107=AB1R107 R108=AB1R108 R109=AB1R109 R110=AB1R110 R111=AB1R111 R112=AB1R112 R113=AB1R113 R114=AB1R114 R115=AB1R115 R116=AB1R116 VD1=AB1VD1 VD2=AB1VD2 VD3=AB1VD3 VD4=AB1VD4 VD5=AB1VD5; ports PWR_2V5=IO_2V5 PWR_5V=IO_5V
A2/AB20: designators C375=AB2C375 C376=AB2C376 C377=AB2C377 C378=AB2C378 C379=AB2C379 C380=AB2C380 C381=AB2C381 C382=AB2C382 C383=AB2C383 C384=AB2C384 C385=AB2C385 C386=AB2C386 C387=AB2C387 C388=AB2C388 C389=AB2C389 C390=AB2C390 C391=AB2C391 C392=AB2C392 C393=AB2C393 C394=AB2C394 C395=AB2C395 C396=AB2C396 C397=AB2C397 C398=AB2C398 C399=AB2C399 C400=AB2C400 D11=AB2D11 D12=AB2D12 G12=AB2G12 R93=AB2R93 R94=AB2R94 R95=AB2R95 R96=AB2R96 R97=AB2R97 R98=AB2R98 R99=AB2R99 R100=AB2R100 R101=AB2R101 R102=AB2R102 R103=AB2R103 R104=AB2R104 R105=AB2R105 R106=AB2R106 R107=AB2R107 R108=AB2R108 R109=AB2R109 R110=AB2R110 R111=AB2R111 R112=AB2R112 R113=AB2R113 R114=AB2R114 R115=AB2R115 R116=AB2R116 VD1=AB2VD1 VD2=AB2VD2 VD3=AB2VD3 VD4=AB2VD4 VD5=AB2VD5; ports PWR_2V5=IO_2V5 PWR_5V=IO_5V

### Layout directives
differential pair: DL0_N_AB19, DL0_P_AB19, DL1_N_AB19, DL1_P_AB19, DL2_N_AB19, DL2_P_AB19, DL3_N_AB19, DL3_P_AB19, ENET_RX_N_AB19, ENET_RX_P_AB19, ENET_RXC_N_AB19, ENET_RXC_P_AB19, ENET_TX_N_AB19, ENET_TX_P_AB19, ENET_TXC_N_AB19, ENET_TXC_P_AB19

### Notes on the sheet
- Элементы R103, R104, C387 расположить компактно.
  Элементы R106, R108, C394 расположить компактно.
  Элементы R110, R111, C399 расположить компактно.
  Элементы R113, R114, C400 расположить компактно.
- (near G12) Конденсатор C375 расположить как можно ближе к G12:4.
- Конденсаторs расположить как можно ближе к выводам AVDD элемента D12.
- (near C378) Конденсатор C387 расположить как можно ближе к D11:3.
  Конденсатор C379 расположить как можно ближе к D11:1.
- Конденсаторы расположить как можно ближе к выводам DVDD элемента D12.
- Подп. дата
- Инв. № дубл.
- Взам. инв. №
- Подп. и дата
- Инв. № подл.
- Изм.
- Лист
- № докум.
- Подп.
- Дата
- ALTIUM GOSTBOM2.0 KEV
- Файл:
- Копировал
- Формат А2
- (in symbol E116, part A) RTX
- (in symbol E116, part B) RTX
- (in symbol E116, part C) RTX
- (in symbol E116, part D) RTX
- (in symbol E117) G
- (in symbol E118) STU